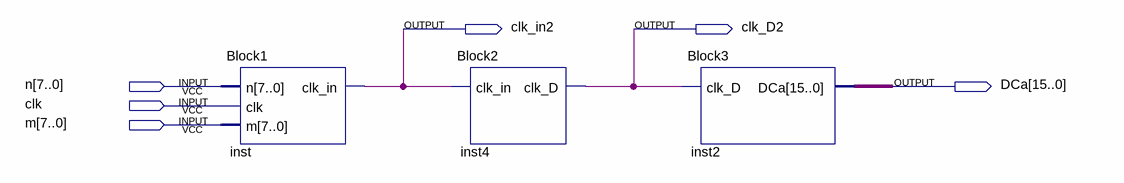
[diagram p0: schematic sheet]
// Quartus schematic Lab_2.bdf as structural Verilog: 3 symbols, 6 pins
module Lab_2 (
  input  [7:0] n,
  input  clk,
  input  [7:0] m,
  output clk_in2,
  output clk_D2,
  output [15:0] DCa
);

  Block1 inst (.n(n), .clk(clk), .m(m), .clk_in(clk_in2));
  Block2 inst4 (.clk_in(clk_in2), .clk_D(clk_D2));
  Block3 inst2 (.clk_D(clk_D2), .DCa(DCa));
endmodule
